# Altium schematic sheet boxer_sensors.SchDoc: Sensory I2C
size A4; DrawnBy: Damian Dolewski; Engineer: Damian Dolewski; DocumentNumber: 1; SheetNumber: 1; SheetTotal: 1
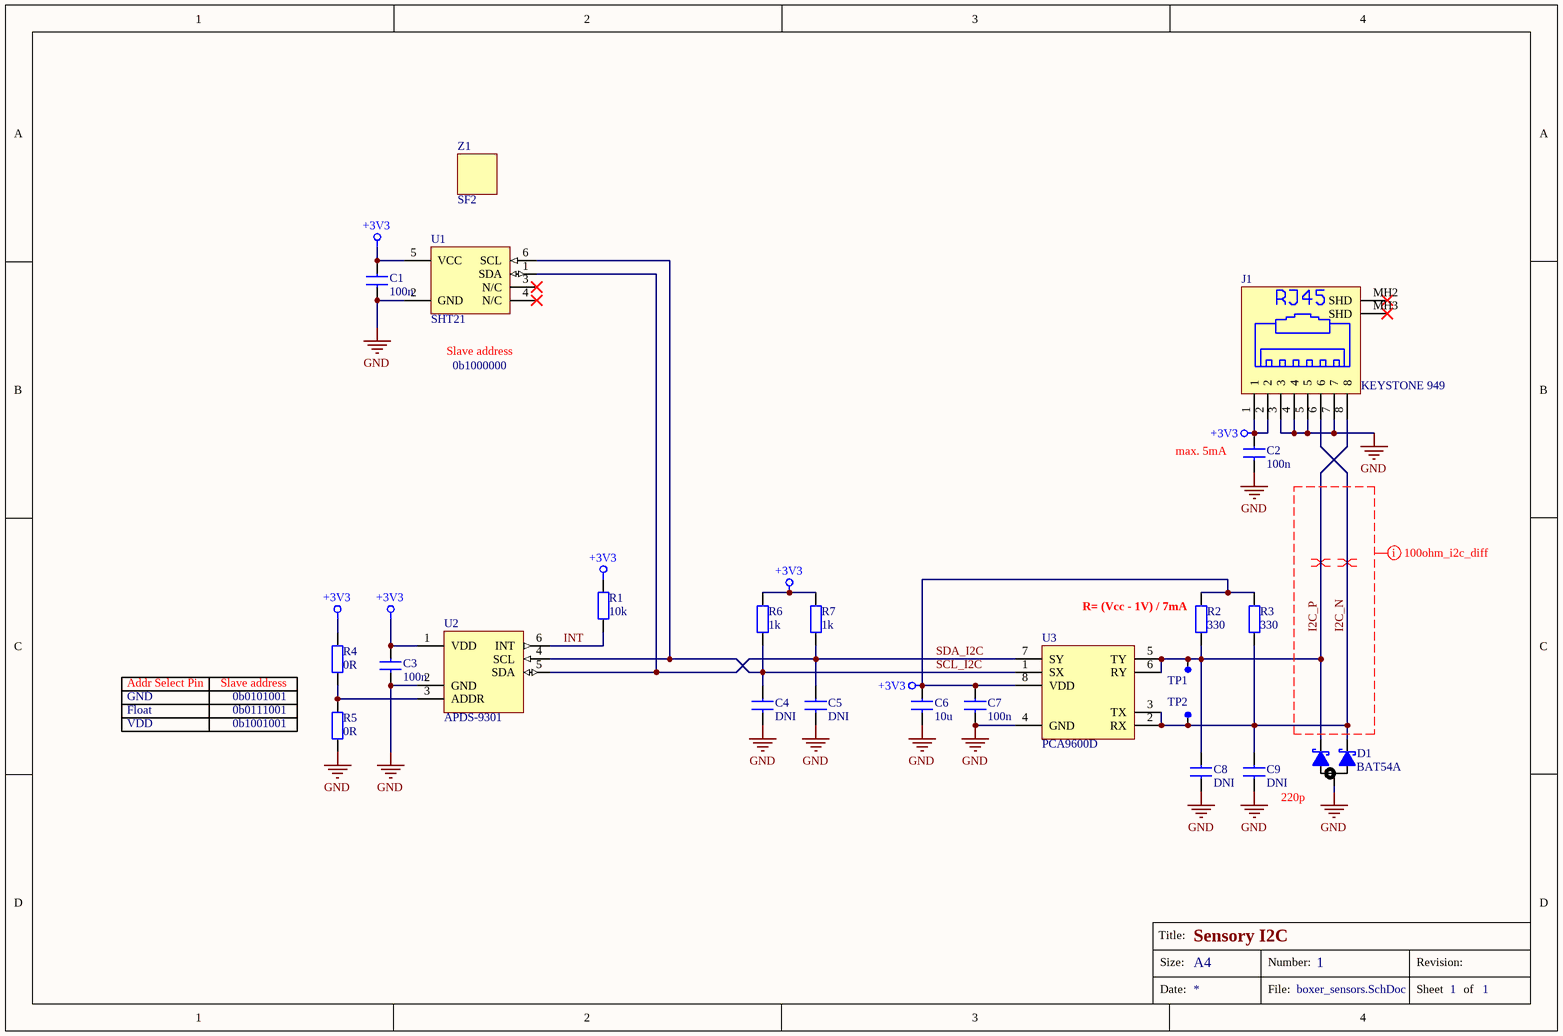
[diagram p0: boxer_sensors.SchDoc]

## Parts
C1  value 100n  [C_0805]  (hidden comment: Capacitor)
C2  value 100n  [C_0805]  (hidden comment: Capacitor)
C3  value 100n  [C_0805]  (hidden comment: Capacitor)
C4  value DNI  [C_0805]  (hidden comment: Capacitor)
C5  value DNI  [C_0805]  (hidden comment: Capacitor)
C6  value 10u  [C_1206]  (hidden comment: Capacitor)
C7  value 100n  [C_0805]  (hidden comment: Capacitor)
C8  value DNI  [C_0805]  (hidden comment: Capacitor)
C9  value DNI  [C_0805]  (hidden comment: Capacitor)
D1  BAT54A  [SOT-23]
J1  KEYSTONE 949  [PN949]
R1  value 10k  [R_0805]  (hidden comment: Resistor)
R2  value 330  [R_0805]  (hidden comment: Resistor)
R3  value 330  [R_0805]  (hidden comment: Resistor)
R4  value 0R  [R_0805]  (hidden comment: Resistor)
R5  value 0R  [R_0805]  (hidden comment: Resistor)
R6  value 1k  [R_0805]  (hidden comment: Resistor)
R7  value 1k  [R_0805]  (hidden comment: Resistor)
TP1  TEST PAD  [PIN]  (value not drawn)
TP2  TEST PAD  [PIN]  (value not drawn)
U1  SHT21  [DFN6]
U2  APDS-9301  [ChipLED]
U3  PCA9600D  [SO8]
Z1  value SF2  [SF2]  (hidden comment: SF2 Filter Cap)

## Nets
+3V3: C1.2 C2.2 C3.2 C6.2 C7.2 J1.1 J1.2 R1.2 R2.2 R3.2 R4.2 R6.2 R7.2 U1.5(VCC) U2.1(VDD) U3.8(VDD)
GND: C1.1 C2.1 C3.1 C4.1 C5.1 C6.1 C7.1 C8.1 C9.1 D1.3(K) J1.3 J1.4 J1.5 J1.7 R5.1 U1.2(GND) U2.2(GND) U3.4(GND)
I2C_N: C9.2 D1.1(A) J1.6 R3.1 TP2.1 U3.2(RX) U3.3(TX)
I2C_P: C8.2 D1.2(A) J1.8 R2.1 TP1.1 U3.5(TY) U3.6(RY)
INT: R1.1 U2.6(INT)
SCL_I2C: C4.2 R6.1 U1.6(SCL) U2.4(SCL) U3.1(SX)
SDA_I2C: C5.2 R7.1 U1.1(SDA) U2.5(SDA) U3.7(SY)
NetR4_1: R4.1 R5.2 U2.3(ADDR)

Not connected (* = marked no-connect by the designer): J1 MH2(SHD)* MH3(SHD)*; U1 3(N/C)* 4(N/C)*

## Layout directives
differential pair: I2C_N, I2C_P
mark named 100ohm_i2c_diff: I2C_N, I2C_P

## Notes on the sheet
- (near U1) Slave address
- 0b1000000
- (near C2) max. 5mA
- (near R2) R= (Vcc - 1V) / 7mA
- Addr Select Pin
- GND
- Float
- Slave address
- 0b0101001
- 0b0111001
- VDD
- 0b1001001
- 220p
- Title:
- Size:
- A4
- Number:
- Revision:
- Date:
- File:
- Sheet
- of

## Library data of the parts
D1 = Diode Schottky3: dual Schottky diode common anode; Value: BAT54A
J1 = RJ45-8: RJ45 (keystone) Jack, Vertical PCB Mount P/N 949; Value: KEYSTONE 949
TP1 TP2 = TEST_PAD
U1 = SHT21: Humidity and Temperature Sensor IC; Value: SHT21
U3 = PCA9600: Dual bidirectional I2C bus buffer; Value: PCA9600D
Z1 = SF2: SF2 Filter Cap  Filter Cap for Humidity &  Temperature Sensors SHT2x
U2 = APDS-9301: Value: APDS-9301